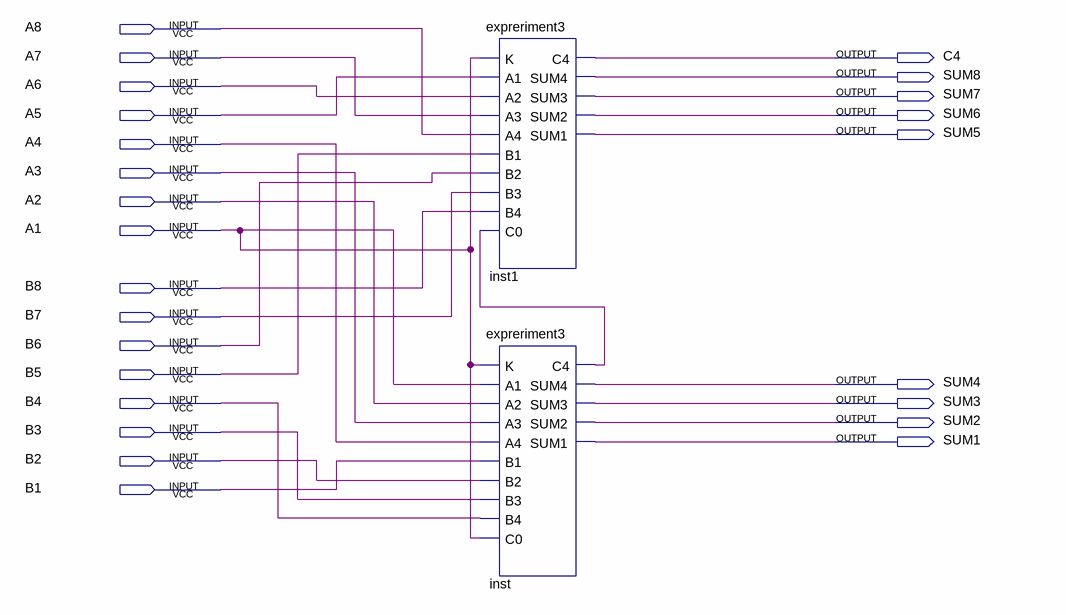
[diagram p0: schematic sheet]
// Quartus schematic experiment3-ex.bdf as structural Verilog: 2 symbols, 25 pins
module \experiment3-ex  (
  input  A8,
  input  A7,
  input  A6,
  input  A5,
  input  A4,
  input  A3,
  input  A2,
  input  A1,
  input  B8,
  input  B7,
  input  B6,
  input  B5,
  input  B4,
  input  B3,
  input  B2,
  input  B1,
  output C4,
  output SUM8,
  output SUM7,
  output SUM6,
  output SUM5,
  output SUM4,
  output SUM3,
  output SUM2,
  output SUM1
);

  wire inst_c4;

  expreriment3 inst1 (
    .K(A1), .A1(A5), .A2(A6), .A3(A7), .A4(A8), .B1(B5), .B2(B6), .B3(B7), .B4(B8), .C0(inst_c4), .C4(C4),
    .SUM4(SUM8), .SUM3(SUM7), .SUM2(SUM6), .SUM1(SUM5));
  expreriment3 inst (
    .K(A1), .A1(A1), .A2(A2), .A3(A3), .A4(A4), .B1(B1), .B2(B2), .B3(B3), .B4(B4), .C0(A1), .C4(inst_c4),
    .SUM4(SUM4), .SUM3(SUM3), .SUM2(SUM2), .SUM1(SUM1));
endmodule
